# EAGLE design mainboard (EAGLE 9.6.2)
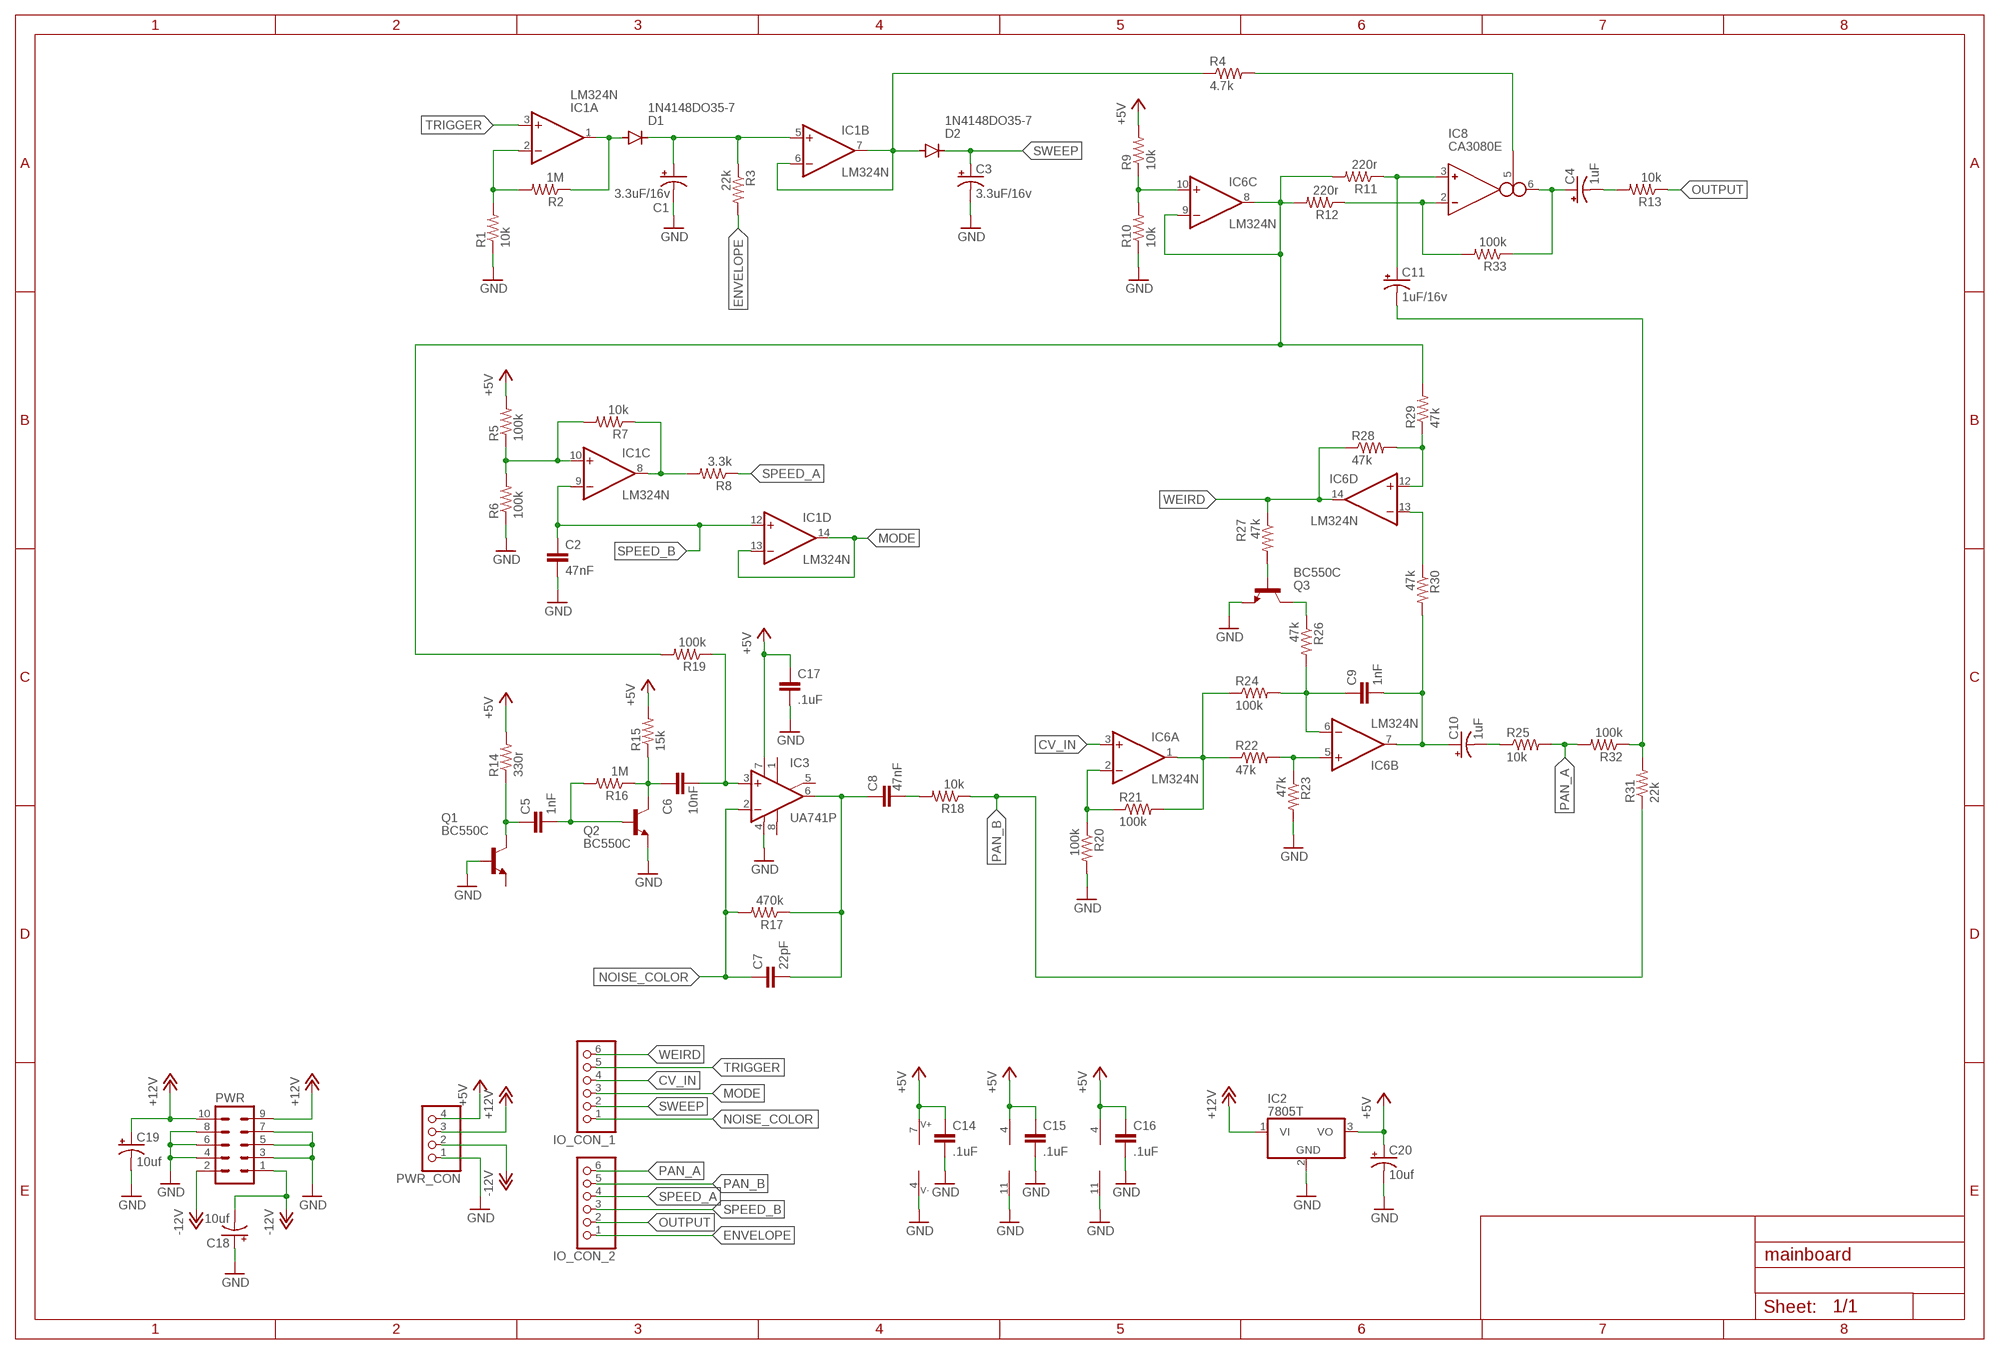
[diagram p0: schematic, sheet 1]

## Parts
C1  3.3uF/16v  CPOL-USE2.5-6  [E2,5-6]
C2  47nF  C-EU050-024X044  [C050-024X044]
C3  3.3uF/16v  CPOL-USE2.5-6  [E2,5-6]
C4  1uF  CPOL-USE2.5-6  [E2,5-6]
C5  1nF  C-EU050-024X044  [C050-024X044]
C6  10nF  C-EU050-024X044  [C050-024X044]
C7  22pF  C-EU050-024X044  [C050-024X044]
C8  47nF  C-EU050-024X044  [C050-024X044]
C9  1nF  C-EU050-024X044  [C050-024X044]
C10  1uF  CPOL-USE2.5-6  [E2,5-6]
C11  1uF/16v  CPOL-USE2.5-6  [E2,5-6]
C14  .1uF  C-EU050-024X044  [C050-024X044]
C15  .1uF  C-EU050-024X044  [C050-024X044]
C16  .1uF  C-EU050-024X044  [C050-024X044]
C17  .1uF  C-EU050-024X044  [C050-024X044]
C18  10uf  CPOL-USE2.5-5  [E2,5-5]
C19  10uf  CPOL-USE2.5-5  [E2,5-5]
C20  10uf  CPOL-USE2.5-5  [E2,5-5]
D1  1N4148DO35-7  [DO35-7]
D2  1N4148DO35-7  [DO35-7]
IC1  LM324N  [DIL14]
IC2  7805T  [TO220H]
IC3  UA741P  [DIL08]
IC6  LM324N  [DIL14]
IC8  CA3080E  [DIL08]
IO_CON_1  PINHD-1X6  [1X06]
IO_CON_2  PINHD-1X6  [1X06]
PWR  ML10  [ML10]
PWR_CON  PINHD-1X4  [1X04]
Q1  BC550C  [TO92-EBC]
Q2  BC550C  [TO92-EBC]
Q3  BC550C  [TO92-EBC]
R1  10k  R-US_0207/7  [0207/7]
R2  1M  R-US_0207/7  [0207/7]
R3  22k  R-US_0207/7  [0207/7]
R4  4.7k  R-US_0207/7  [0207/7]
R5  100k  R-US_0207/7  [0207/7]
R6  100k  R-US_0207/7  [0207/7]
R7  10k  R-US_0207/7  [0207/7]
R8  3.3k  R-US_0207/7  [0207/7]
R9  10k  R-US_0207/7  [0207/7]
R10  10k  R-US_0207/7  [0207/7]
R11  220r  R-US_0207/7  [0207/7]
R12  220r  R-US_0207/7  [0207/7]
R13  10k  R-US_0207/7  [0207/7]
R14  330r  R-US_0207/7  [0207/7]
R15  15k  R-US_0207/7  [0207/7]
R16  1M  R-US_0207/7  [0207/7]
R17  470k  R-US_0207/7  [0207/7]
R18  10k  R-US_0207/7  [0207/7]
R19  100k  R-US_0207/7  [0207/7]
R20  100k  R-US_0207/7  [0207/7]
R21  100k  R-US_0207/7  [0207/7]
R22  47k  R-US_0207/7  [0207/7]
R23  47k  R-US_0207/7  [0207/7]
R24  100k  R-US_0207/7  [0207/7]
R25  10k  R-US_0207/7  [0207/7]
R26  47k  R-US_0207/7  [0207/7]
R27  47k  R-US_0207/7  [0207/7]
R28  47k  R-US_0207/7  [0207/7]
R29  47k  R-US_0207/7  [0207/7]
R30  47k  R-US_0207/7  [0207/7]
R31  22k  R-US_0207/7  [0207/7]
R32  100k  R-US_0207/7  [0207/7]
R33  100k  R-US_0207/7  [0207/7]

## Nets
+5V: C14.1 C15.1 C16.1 C17.1 C20.+ IC1.4(P:V+) IC2.3(VO) IC3.7(V+) IC6.4(P:V+) IC8.7(V+) PWR_CON.4 R5.2 R9.2 R14.2 R15.2
+12V: C19.+ IC2.1(VI) PWR.9 PWR.10 PWR_CON.3
-12V: C18.- PWR.1 PWR.2 PWR_CON.2
CV_IN: IC6.3(A:+IN) IO_CON_1.4
ENVELOPE: IO_CON_2.1 R3.2
GND: C1.- C2.2 C3.- C14.2 C15.2 C16.2 C17.2 C18.+ C19.- C20.- IC1.11(P:V-) IC2.2(GND) IC3.4(V-) IC6.11(P:V-) IC8.4(V-) PWR.3 PWR.4 PWR.5 PWR.6 PWR.7 PWR.8 PWR_CON.1 Q1.B Q2.E Q3.E R1.1 R6.1 R10.1 R20.2 R23.2
MODE: IC1.13(D:-IN) IC1.14(D:OUT) IO_CON_1.3
N$1: IC1.2(A:-IN) R1.2 R2.2
N$2: D1.A IC1.1(A:OUT) R2.1
N$3: C1.+ D1.C IC1.5(B:+IN) R3.1
N$4: IC1.10(C:+IN) R5.1 R6.2 R7.2
N$5: D2.A IC1.6(B:-IN) IC1.7(B:OUT) R4.1
N$6: IC8.5(I_BIAS) R4.2
N$7: IC1.8(C:OUT) R7.1 R8.2
N$8: IC6.10(C:+IN) R9.1 R10.2
N$9: IC6.8(C:OUT) IC6.9(C:-IN) R11.2 R12.2 R19.2 R29.2
N$10: C11.+ IC8.3(IN_P) R11.1
N$11: C4.+ IC8.6(OUT) R33.1
N$12: C5.1 Q1.C R14.1
N$13: C5.2 Q2.B R16.2
N$14: C4.- R13.2
N$15: C6.1 Q2.C R15.1 R16.1
N$16: C6.2 IC3.3(+IN) R19.1
N$17: C8.2 R18.2
N$18: C7.2 C8.1 IC3.6(OUT) R17.1
N$19: IC6.5(B:+IN) R22.2 R23.1
N$20: IC6.2(A:-IN) R20.1 R21.1
N$21: IC6.1(A:OUT) R21.2 R22.1 R24.1
N$22: C9.1 IC6.6(B:-IN) R24.2 R26.2
N$23: C9.2 C10.+ IC6.7(B:OUT) R30.2
N$24: C10.- R25.1
N$26: Q3.C R26.1
N$27: Q3.B R27.2
N$28: IC8.2(IN_N) R12.1 R33.2
N$29: IC6.13(D:-IN) R30.1
N$30: C11.- R31.2 R32.1
N$31: IC6.12(D:+IN) R28.2 R29.1
NOISE_COLOR: C7.1 IC3.2(-IN) IO_CON_1.1 R17.2
OUTPUT: IO_CON_2.2 R13.1
PAN_A: IO_CON_2.6 R25.2 R32.2
PAN_B: IO_CON_2.5 R18.1 R31.1
SPEED_A: IO_CON_2.4 R8.1
SPEED_B: C2.1 IC1.9(C:-IN) IC1.12(D:+IN) IO_CON_2.3
SWEEP: C3.+ D2.C IO_CON_1.2
TRIGGER: IC1.3(A:+IN) IO_CON_1.5
WEIRD: IC6.14(D:OUT) IO_CON_1.6 R27.1 R28.1
Unconnected: IC3.1(ON1) IC3.5(ON2) IC3.8(OPT) Q1.E

## Library data of the parts
C1 C3 C4 C10 C11 = rcl:CPOL-US: POLARIZED CAPACITOR, American symbol; SPICEPREFIX: C
C2 C5-C9 C14-C17 = rcl:C-EU: CAPACITOR, European symbol; SPICEPREFIX: C
C18-C20 = resistor:CPOL-US: POLARIZED CAPACITOR, American symbol
D1 D2 = diode:1N4148: DIODE high speed (Philips)
IC1 IC6 = linear:LM324: OP AMP
IC2 = linear:78*: Positive VOLTAGE REGULATOR Source: http://cache.national.com/ds/LM/LM78L05.pdf http://www.fairchildsemi.com/ds/LM/LM7805.pdf
IC3 = linear:*741: OP AMP
IC8 = ota:CA3080: OTA
IO_CON_1 IO_CON_2 = pinhead:PINHD-1X6: PIN HEADER
PWR = con-ml:ML10: HARTING; OC_FARNELL: unknown; OC_NEWARK: unknown
PWR_CON = pinhead:PINHD-1X4: PIN HEADER
Q1-Q3 = transistor-npn:BC550*: NPN Transistor
R1-R33 = rcl:R-US_: RESISTOR, American symbol; SPICEPREFIX: R

## Board
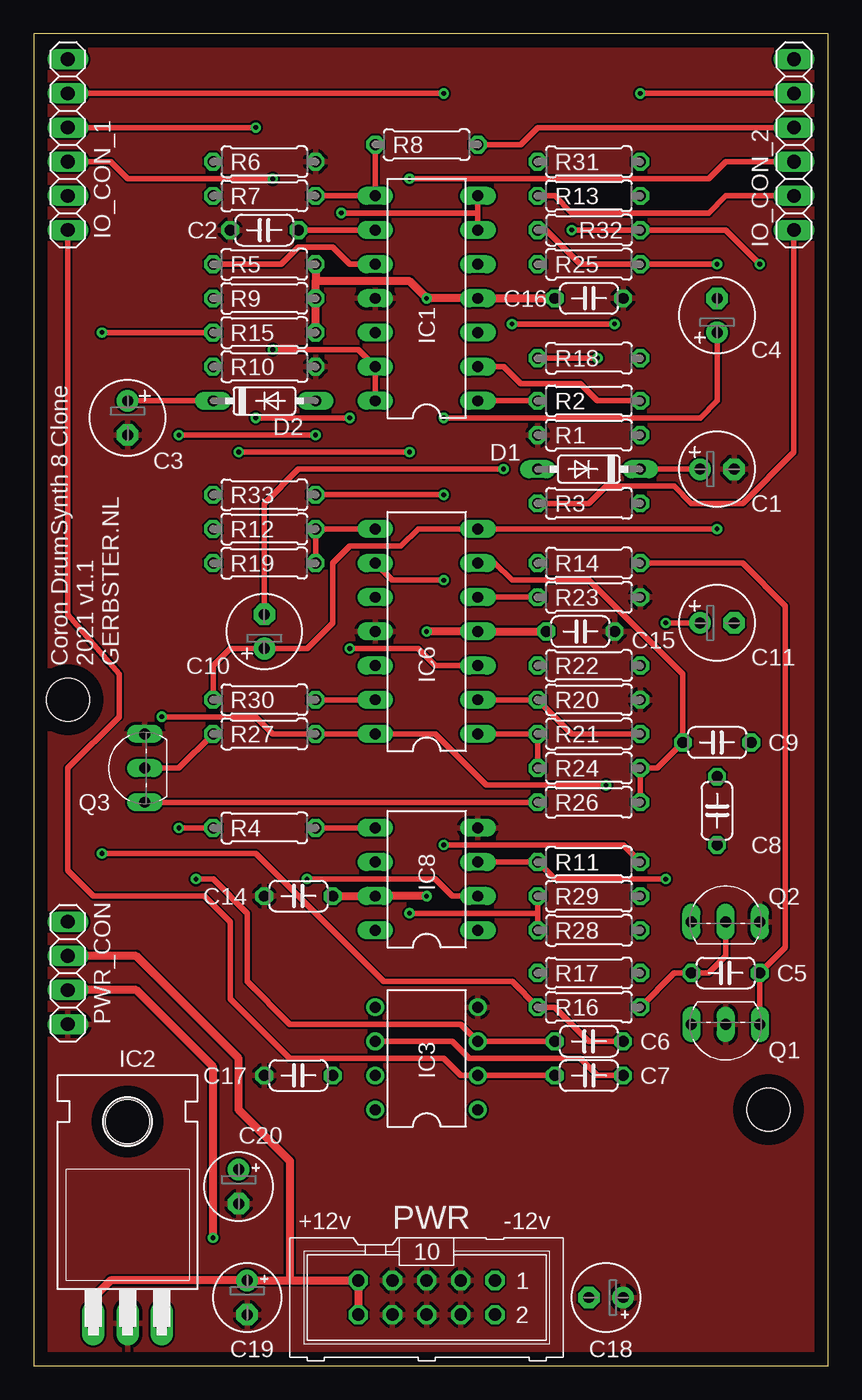
[diagram p1: board, top side]
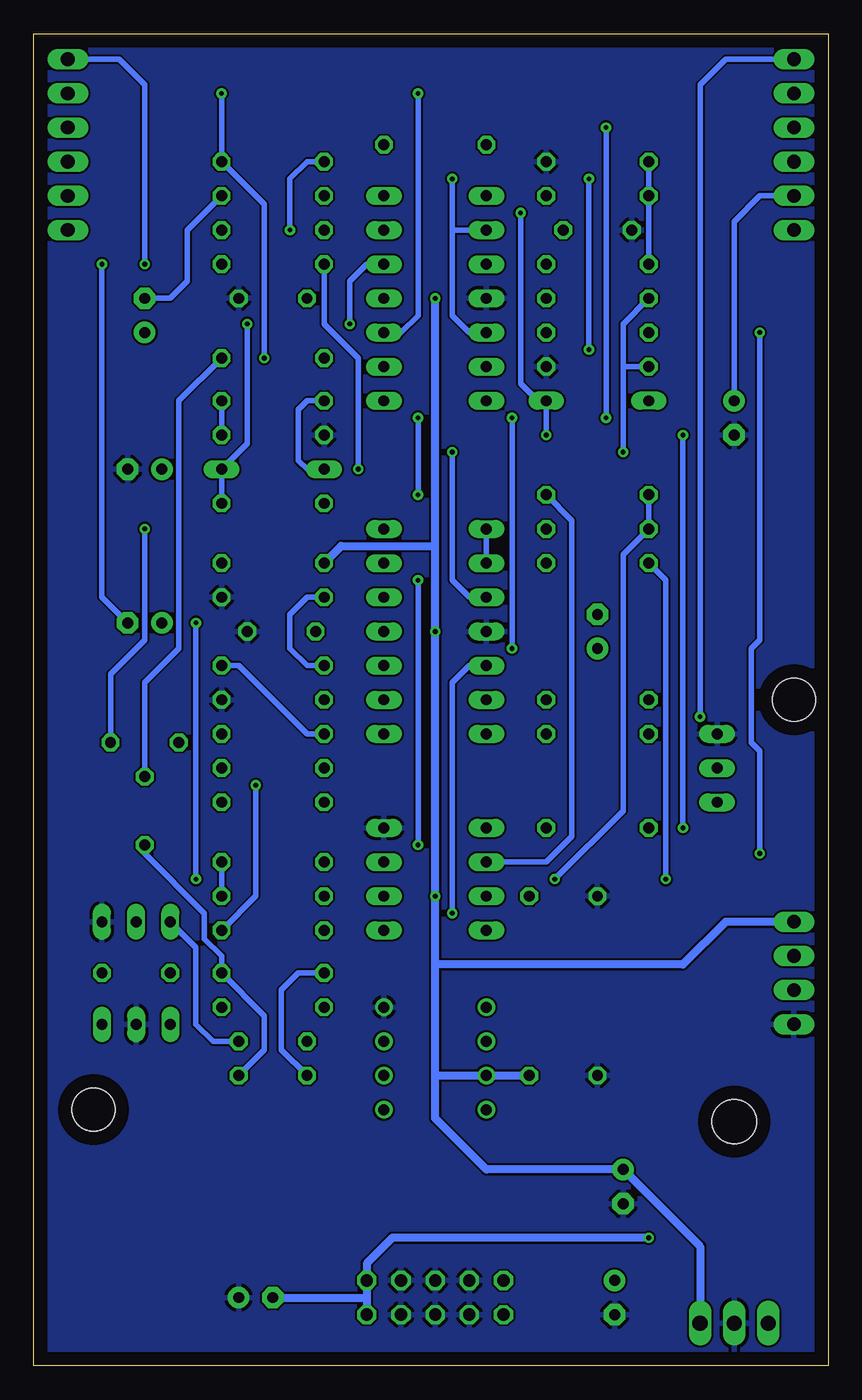
[diagram p2: board, bottom side, seen from below]

Size 59.05 x 99.06 mm. Coordinates in mm from the lower left corner, seen from the top.
Outline: 0,0 59.05,0 59.05,99.06 0,99.05 0,0
Copper layers (1*16): Top 0.035mm / dielectric 1.5mm / Bottom 0.035mm
Design rules "default": minimum track width 6mil, minimum drill 0.35mm, track to track 6mil, track to pad 6mil, pad to pad 6mil, via to via 6mil, smd to smd 6mil, copper to edge 40mil, drill to drill 6mil, minimum pad ring 10mil, minimum via ring 8mil, stop-mask expansion 4mil, vias tented up to drill 0mil, thermal gap 10mil
Holes 3.2 mm at 54.61,19.05 2.54,49.53

### Footprints (pad centres in the part's own frame; a part is rotated, then mirrored left to right if it is on the bottom)
E2,5-6 = drill 0.813 pad 1.6: + -1.27,0 | drill 0.813 pad 1.6 octagon: - 1.27,0
C050-024X044 = drill 0.813 octagon: 1 -2.54,0; 2 2.54,0
E2,5-5 = drill 0.813 pad 1.6: + -1.27,0 | drill 0.813 pad 1.6 octagon: - 1.27,0
DO35-7 = drill 0.813 long: A 3.81,0; C -3.81,0
DIL14 = drill 0.813 long: 1 -7.62,-3.81; 2 -5.08,-3.81; 3 -2.54,-3.81; 4 0,-3.81; 5 2.54,-3.81; 6 5.08,-3.81; 7 7.62,-3.81; 8 7.62,3.81; 9 5.08,3.81; 10 2.54,3.81; 11 0,3.81; 12 -2.54,3.81; 13 -5.08,3.81; 14 -7.62,3.81
TO220H = drill 1.118 long: 1 -2.54,-10.16; 2 0,-10.16; 3 2.54,-10.16 | hole 3.302: 0,4.826
DIL08 = drill 0.813 pad 1.27: 1 -3.81,-3.81; 2 -1.27,-3.81; 3 1.27,-3.81; 4 3.81,-3.81; 5 3.81,3.81; 6 1.27,3.81; 7 -1.27,3.81; 8 -3.81,3.81
DIL08' = drill 0.813 long: 1 -3.81,-3.81; 2 -1.27,-3.81; 3 1.27,-3.81; 4 3.81,-3.81; 5 3.81,3.81; 6 1.27,3.81; 7 -1.27,3.81; 8 -3.81,3.81
1X06 = drill 1.016 long: 1 -6.35,0; 2 -3.81,0; 3 -1.27,0; 4 1.27,0; 5 3.81,0; 6 6.35,0
ML10 = drill 0.914 octagon: 1 -5.08,-1.27; 2 -5.08,1.27; 3 -2.54,-1.27; 4 -2.54,1.27; 5 0,-1.27; 6 0,1.27; 7 2.54,-1.27; 8 2.54,1.27; 9 5.08,-1.27; 10 5.08,1.27
1X04 = drill 1.016 long: 1 -3.81,0; 2 -1.27,0; 3 1.27,0; 4 3.81,0
TO92-EBC = drill 0.813 long: B 0,-1.27; C -2.54,-1.27; E 2.54,-1.27
0207/7 = drill 0.813 octagon: 1 -3.81,0; 2 3.81,0

### Placement (x,y rotation side)
C1  50.8,66.67 0 top
C2  17.14,84.45 180 top
C3  6.99,70.48 270 top
C4  50.8,78.11 90 top
C5  51.44,29.21 180 top
C6  41.27,24.13 180 top
C7  41.27,21.59 0 top
C8  50.8,41.27 90 top
C9  50.8,46.35 0 top
C10  17.14,54.61 90 top
C11  50.8,55.24 0 top
C14  19.68,34.92 180 top
C15  40.64,54.61 0 top
C16  41.27,79.38 0 top
C17  19.68,21.59 180 top
C18  42.55,5.08 180 top
C19  15.88,5.08 270 top
C20  15.24,13.34 270 top
D1  41.27,66.67 180 top
D2  17.14,71.75 0 top
IC1  29.21,79.38 90 top
IC2  6.99,13.34 0 top
IC3  29.21,22.86 90 top
IC6  29.21,54.61 90 top
IC8  CA3080E  [DIL08']  29.21,36.2 90 top
IO_CON_1  2.54,90.81 90 top
IO_CON_2  56.52,90.81 90 top
PWR  29.21,5.08 180 top
PWR_CON  2.54,29.21 90 top
Q1  51.44,24.13 180 top
Q2  51.44,34.29 0 top
Q3  6.99,44.45 90 top
R1  41.27,69.22 0 top
R2  41.27,71.75 0 top
R3  41.27,64.14 180 top
R4  17.14,40.01 0 top
R5  17.14,81.92 0 top
R6  17.14,89.53 180 top
R7  17.14,87 180 top
R8  29.21,90.81 180 top
R9  17.14,79.38 0 top
R10  17.14,74.3 180 top
R11  41.27,37.47 0 top
R12  17.14,62.23 0 top
R13  41.27,87 0 top
R14  41.27,59.69 180 top
R15  17.14,76.83 0 top
R16  41.27,26.67 0 top
R17  41.27,29.21 180 top
R18  41.27,74.93 0 top
R19  17.14,59.69 0 top
R20  41.27,49.53 0 top
R21  41.27,46.99 180 top
R22  41.27,52.07 180 top
R23  41.27,57.15 0 top
R24  41.27,44.45 0 top
R25  41.27,81.92 0 top
R26  41.27,41.91 0 top
R27  17.14,46.99 180 top
R28  41.27,32.38 180 top
R29  41.27,34.92 0 top
R30  17.14,49.53 180 top
R31  41.27,89.53 180 top
R32  41.27,84.45 180 top
R33  17.14,64.77 180 top

### Tracks (layer width: path | path; a pad name or v marks a point on that pad's centre or on a via)
+5V  (via drill 0.35)
  Top 0.61: 20.95,80.64 R9.2 R15.2 | R5.2 20.95,80.64 | C14.1 IC8.7 v29.21,34.92 | v29.21,54.61 IC6.4 C15.1 | C16.1 IC1.4 v29.21,79.38 27.94,80.64 20.95,80.64
  Bottom 0.61: 29.21,21.59 29.21,18.41 25.4,14.61 C20.+ 9.53,8.89 IC2.3 | 29.21,21.59 IC3.7 C17.1 | 29.21,21.59 29.21,29.84 | 29.21,29.84 v29.21,34.92 v29.21,54.61 29.21,60.96 | 29.21,60.96 v29.21,79.38 | R14.2 36.2,60.96 29.21,60.96 | PWR_CON.4 7.62,33.02 10.79,29.84 29.21,29.84
+12V
  Top 0.61: PWR_CON.3 7.62,30.48 15.24,22.86 15.24,19.05 19.05,15.24 19.05,6.35 | IC2.1 4.45,5.08 5.71,6.35 C19.+ 19.05,6.35 | 19.05,6.35 PWR.9 PWR.10
-12V  (via drill 0.35)
  Top 0.61: v13.34,9.53 13.34,22.23 7.62,27.94 PWR_CON.2
  Bottom 0.61: v13.34,9.53 32.38,9.53 34.29,7.62 PWR.1 34.29,5.08 | 34.29,5.08 PWR.2 | C18.- 34.29,5.08
CV_IN  (via drill 0.35)
  Top 0.406: IC6.3 29.84,52.07 28.57,53.34 v23.5,53.34 | v16.51,92.08 IO_CON_1.4 | v23.5,70.48 v16.51,70.48
  Bottom 0.406: v23.5,53.34 v23.5,70.48 | v16.51,70.48 v16.51,92.08
ENVELOPE
  Top 0.406: R3.2 41.27,64.14 42.55,65.41 47.62,65.41 48.9,64.14 52.7,64.14 56.52,67.94 IO_CON_2.1
GND
  pour Top: 0,0 0,99.06 59.05,99.06 59.05,0
  pour Bottom: 0,0 59.05,0 59.05,99.06 0,99.06
MODE  (via drill 0.35)
  Top 0.406: IC1.14 IC1.13 24.13,75.56 v17.78,75.56 | v17.78,88.27 6.99,88.27 5.71,89.53 IO_CON_1.3
  Bottom 0.406: v17.78,75.56 v17.78,88.27
N$1
  Top 0.406: IC1.2 34.92,74.3 36.2,73.03 40.64,73.03 41.91,71.75 R2.2
  Bottom 0.406: R1.2 R2.2
N$2
  Top 0.406: IC1.1 R2.1
  Bottom 0.406: R2.1 38.73,71.75 39.37,71.12 39.37,67.31 38.73,66.67 D1.A
N$3  (via drill 0.35)
  Top 0.406: C1.+ D1.C | v35.56,77.47 v43.18,77.47
  Bottom 0.406: R3.1 D1.C 43.18,68.58 v43.18,77.47 | IC1.5 34.29,81.92 35.56,80.64 v35.56,77.47
N$4
  Top 0.406: R5.1 18.41,81.92 19.68,83.19 22.23,83.19 23.5,81.92 IC1.10
  Bottom 0.406: R6.2 R7.2 R5.1
N$5  (via drill 0.35)
  Top 0.406: IC1.6 33.02,85.72 | 33.02,85.72 IC1.7 | 33.02,85.72 v22.86,85.72 | v20.95,69.22 v10.79,69.22 | v10.79,40.01 R4.1
  Bottom 0.406: v22.86,85.72 22.86,73.03 21.59,71.75 D2.A v20.95,69.22 | v10.79,69.22 v10.79,40.01
N$6
  Top 0.406: R4.2 IC8.5
N$7
  Top 0.406: R7.1 IC1.8 R8.2
N$8  (via drill 0.35)
  Top 0.406: v15.24,67.94 v27.94,67.94
  Bottom 0.406: R9.1 15.24,77.47 15.24,74.3 | R10.2 15.24,74.3 | 15.24,74.3 v15.24,67.94 | v27.94,67.94 27.94,58.42 26.67,57.15 IC6.10
N$9  (via drill 0.35)
  Top 0.406: IC6.8 R12.2 R19.2 | IC6.9 26.67,58.42 v30.48,58.42 | v30.48,38.73 43.81,38.73 R11.2
  Bottom 0.406: IC6.8 IC6.9 | v30.48,58.42 v30.48,38.73 | R11.2 R29.2
N$10  (via drill 0.35)
  Top 0.406: IC8.3 R11.1 38.73,36.2 v46.99,36.2 | C11.+ v46.99,55.24
  Bottom 0.406: v46.99,55.24 v46.99,36.2
N$11  (via drill 0.35)
  Top 0.406: C4.+ 50.8,71.75 49.53,70.48 v30.48,70.48 | v30.48,64.77 R33.1
  Bottom 0.406: v30.48,70.48 v30.48,64.77 | R33.1 19.05,62.87 19.05,39.37 20.95,37.47 IC8.6
N$12
  Top 0.406: Q1.C C5.1 55.88,31.11 55.88,56.52 52.7,59.69 R14.1
N$13
  Top 0.406: Q2.B 51.44,30.48 50.16,29.21 C5.2 47.62,29.21 R16.2
N$14
  Bottom 0.406: R13.2 47.62,84.45 47.62,80.64 48.9,79.38 C4.-
N$15  (via drill 0.35)
  Top 0.406: C6.1 41.27,24.13 38.73,26.67 R16.1 35.56,28.57 26.04,28.57 16.51,38.1 v5.08,38.1 | R15.1 v5.08,76.83
  Bottom 0.406: C6.1 45.72,24.13 46.99,25.4 46.99,31.11 Q2.C | v5.08,76.83 5.08,53.98 5.71,53.34 5.71,46.35 5.08,45.72 v5.08,38.1
N$16  (via drill 0.35)
  Top 0.406: C6.2 IC3.3 31.75,25.4 19.05,25.4 15.88,28.57 15.88,33.66 13.34,36.2 v12.06,36.2
  Bottom 0.406: v12.06,36.2 12.06,58.42 R19.1
N$17
  Bottom 0.406: R18.2 48.26,71.75 48.26,53.34 50.8,50.8 C8.2
N$18
  Top 0.406: IC3.6 31.11,24.13 32.38,22.86 40.64,22.86 41.91,21.59 C7.2
  Bottom 0.406: C8.1 50.8,38.1 46.35,33.66 46.35,31.75 45.09,30.48 R17.1 41.91,26.04 41.91,23.5 C7.2
N$19
  Top 0.406: IC6.5 R23.1
  Bottom 0.406: R23.1 38.73,57.15 40.01,55.88 40.01,53.34 38.73,52.07 R22.2
N$20
  Top 0.406: IC6.2 R20.1 40.01,46.99 R21.1
N$21
  Top 0.406: IC6.1 R21.2 R24.1
  Bottom 0.406: R21.2 38.73,46.99 43.81,52.07 R22.1
N$22
  Top 0.406: R26.2 R24.2 46.35,44.45 C9.1 48.26,51.44 41.27,58.42 35.56,58.42 34.29,59.69 IC6.6
N$23  (via drill 0.35)
  Top 0.406: v50.8,62.23 IC6.7 28.57,62.23 27.3,60.96 23.5,60.96 22.23,59.69 22.23,55.24 20.32,53.34 C10.+ 14.61,53.34 13.34,52.07 R30.2
  Bottom 0.406: C9.2 53.34,51.44 50.8,53.98 v50.8,62.23
N$24  (via drill 0.35)
  Top 0.406: v34.92,66.67 19.68,66.67 17.14,64.14 C10.-
  Bottom 0.406: v34.92,66.67 34.92,74.93 37.47,77.47 R25.1
N$26
  Top 0.406: R26.1 Q3.C
N$27
  Top 0.406: Q3.B 10.79,44.45 R27.2
N$28  (via drill 0.35)
  Top 0.406: v20.32,36.2 29.84,36.2 31.11,34.92 IC8.2
  Bottom 0.406: R33.2 R12.1 15.24,60.33 15.24,41.27 v20.32,36.2
N$29
  Top 0.406: IC6.13 R30.1
N$30  (via drill 0.35)
  Top 0.406: v40.01,84.45 R32.1 51.44,84.45 v53.98,81.92
  Bottom 0.406: R31.2 38.73,89.53 40.01,88.27 v40.01,84.45 | C11.- 53.98,57.15 v53.98,81.92
N$31  (via drill 0.35)
  Top 0.406: R28.2 37.47,33.66 | 37.47,33.66 R29.1 | v27.94,33.66 37.47,33.66
  Bottom 0.406: IC6.12 26.67,52.07 27.94,50.8 v27.94,33.66
NOISE_COLOR
  Top 0.406: C7.1 IC3.2 31.75,21.59 30.48,22.86 19.05,22.86 14.61,27.3 14.61,33.02 12.7,34.92 4.45,34.92 2.54,36.83 2.54,44.45 6.35,48.26 6.35,51.44 2.54,55.88 IO_CON_1.1
  Bottom 0.406: R17.2 39.37,29.21 40.64,27.94 40.64,23.5 C7.1
OUTPUT
  Top 0.406: R13.1 38.73,87 40.01,85.72 50.16,85.72 51.44,87 IO_CON_2.2
PAN_A  (via drill 0.35)
  Top 0.406: R32.2 38.1,84.45 40.64,81.92 R25.2 v50.8,81.92
  Bottom 0.406: v50.8,81.92 50.8,95.25 52.7,97.16 IO_CON_2.6
PAN_B  (via drill 0.35)
  Top 0.406: R18.1 v41.91,74.93 | IO_CON_2.5 v45.09,94.61
  Bottom 0.406: v45.09,94.61 R31.1 41.91,86.36 v41.91,74.93
SPEED_A
  Top 0.406: R8.1 36.2,90.81 37.47,92.08 IO_CON_2.4
SPEED_B  (via drill 0.35)
  Top 0.406: IC1.9 C2.1 | v27.94,88.27 50.16,88.27 51.44,89.53 IO_CON_2.3
  Bottom 0.406: v27.94,88.27 27.94,84.45 | 27.94,84.45 IC1.9 | IC1.12 26.67,76.83 27.94,78.11 27.94,84.45
SWEEP
  Top 0.406: C3.+ D2.C
  Bottom 0.406: IO_CON_1.2 5.08,87 6.99,85.09 C3.+
TRIGGER  (via drill 0.35)
  Top 0.406: IO_CON_1.5 v30.48,94.61
  Bottom 0.406: v30.48,94.61 30.48,78.11 31.75,76.83 IC1.3
WEIRD  (via drill 0.35)
  Top 0.406: v42.55,43.18 33.66,43.18 29.84,46.99 IC6.14 R27.1 17.78,46.99 16.51,48.26 v9.53,48.26
  Bottom 0.406: R28.1 42.55,34.92 v42.55,43.18 | v9.53,48.26 9.53,95.25 7.62,97.16 IO_CON_1.6

### Text on the board
tNames: Coron DrumSynth 8 Clone / 2021 v1.1 / GERBSTER.NL | +12v | -12v